# Altium schematic sheet Power.SchDoc
size A3
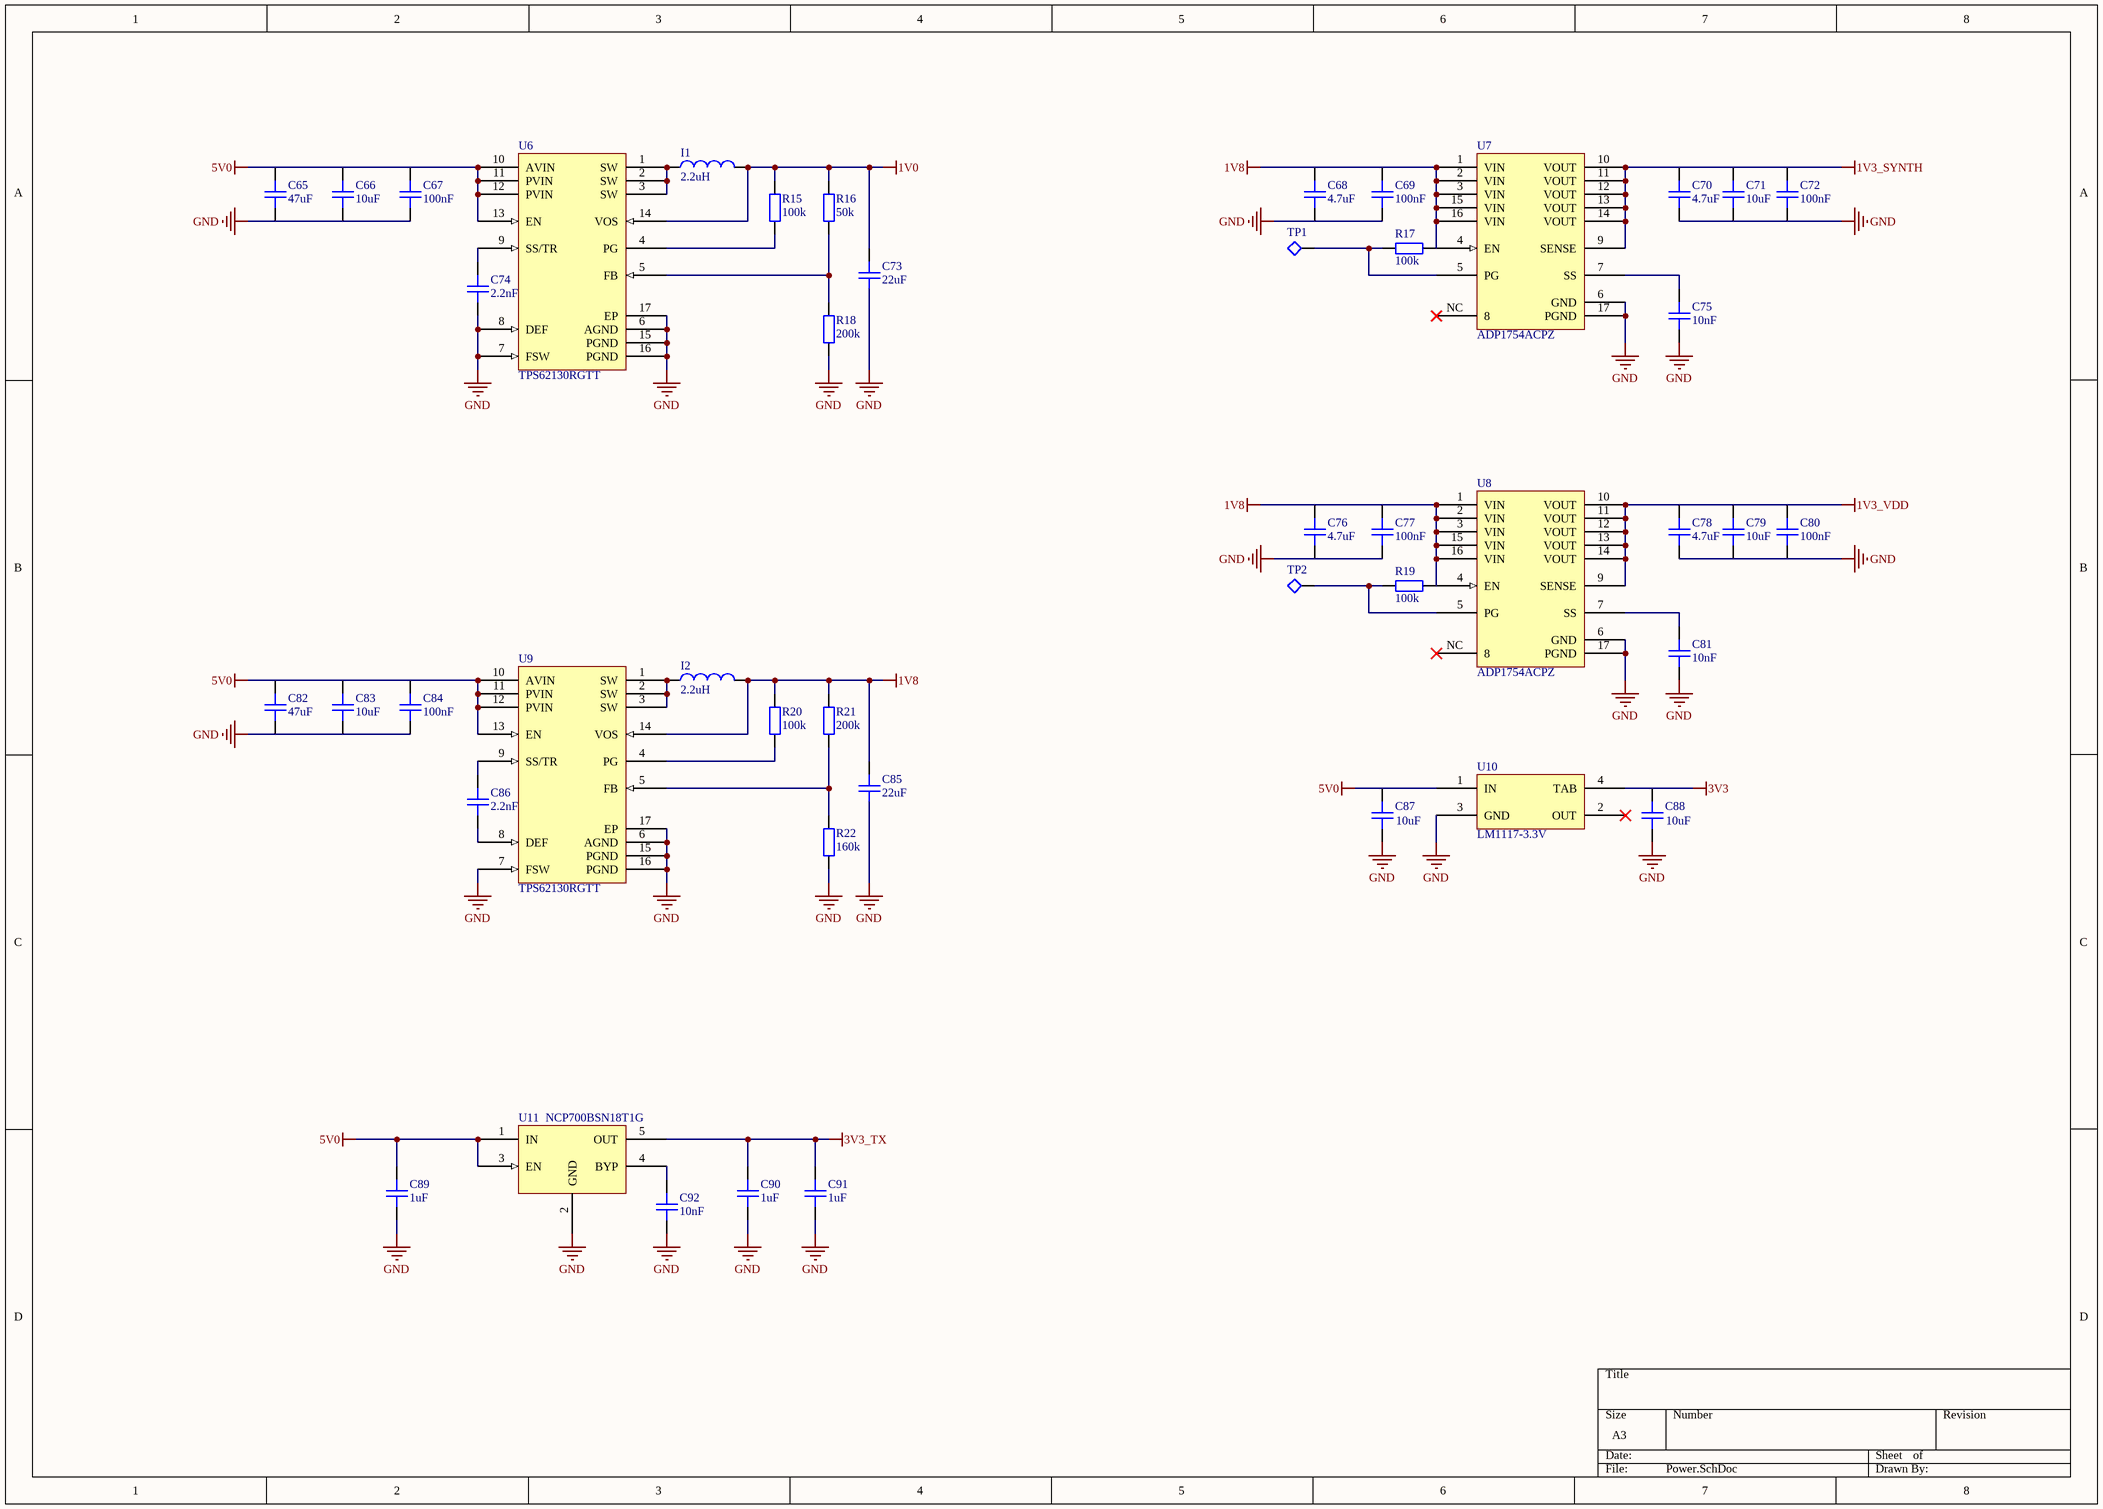
[diagram p0: Power.SchDoc]

## Parts
C65  47uF  [CAP0402]
C66  10uF  [CAP0402]
C67  100nF  [CAP0402]
C68  4.7uF  [CAP0402]
C69  100nF  [CAP0402]
C70  4.7uF  [CAP0402]
C71  10uF  [CAP0402]
C72  100nF  [CAP0402]
C73  22uF  [CAP0402]
C74  2.2nF  [CAP0402]
C75  10nF  [CAP0402]
C76  4.7uF  [CAP0402]
C77  100nF  [CAP0402]
C78  4.7uF  [CAP0402]
C79  10uF  [CAP0402]
C80  100nF  [CAP0402]
C81  10nF  [CAP0402]
C82  47uF  [CAP0402]
C83  10uF  [CAP0402]
C84  100nF  [CAP0402]
C85  22uF  [CAP0402]
C86  2.2nF  [CAP0402]
C87  10uF  [CAP0402]
C88  10uF  [CAP0402]
C89  1uF  [CAP0402]
C90  1uF  [CAP0402]
C91  1uF  [CAP0402]
C92  10nF  [CAP0402]
I1  2.2uH
I2  2.2uH
R15  100k  [RES0402]
R16  50k  [RES0402]
R17  100k  [RES0402]
R18  200k  [RES0402]
R19  100k  [RES0402]
R20  100k  [RES0402]
R21  200k  [RES0402]
R22  160k  [RES0402]
TP1  TP  (value not drawn)
TP2  TP  (value not drawn)
U6  TPS62130RGTT  [QFN50P300X300X80_HS-17N]
U7  ADP1754ACPZ  [QFN65P400X400X80_HS-17N]
U8  ADP1754ACPZ  [QFN65P400X400X80_HS-17N]
U9  TPS62130RGTT  [QFN50P300X300X80_HS-17N]
U10  LM1117-3.3V
U11  NCP700BSN18T1G

## Nets
1V0: I1.2 U6.14(VOS)
1V3_SYNTH: U7.9(SENSE) U7.10(VOUT) U7.11(VOUT) U7.12(VOUT) U7.13(VOUT) U7.14(VOUT)
1V3_VDD: U8.9(SENSE) U8.10(VOUT) U8.11(VOUT) U8.12(VOUT) U8.13(VOUT) U8.14(VOUT)
1V8: I2.2 U7.1(VIN) U7.2(VIN) U7.3(VIN) U7.4(EN) U7.15(VIN) U7.16(VIN) U8.1(VIN) U8.2(VIN) U8.3(VIN) U8.4(EN) U8.15(VIN) U8.16(VIN) U9.14(VOS)
3V3: U10.4(TAB)
3V3_TX: U11.5(OUT)
5V0: U6.10(AVIN) U6.11(PVIN) U6.12(PVIN) U6.13(EN) U9.10(AVIN) U9.11(PVIN) U9.12(PVIN) U9.13(EN) U10.1(IN) U11.1(IN) U11.3(EN)
GND: C73.1 C85.1 U6.6(AGND) U6.7(FSW) U6.8(DEF) U6.15(PGND) U6.16(PGND) U6.17(EP) U7.6(GND) U7.17(PGND) U8.6(GND) U8.17(PGND) U9.6(AGND) U9.7(FSW) U9.15(PGND) U9.16(PGND) U9.17(EP) U10.3(GND) U11.2(GND)
NetI1_1: I1.1 U6.1(SW) U6.2(SW) U6.3(SW)
NetI2_1: I2.1 U9.1(SW) U9.2(SW) U9.3(SW)
NetTP1_1: TP1.1(NC) U7.5(PG)
NetTP2_1: TP2.1(NC) U8.5(PG)

Not connected (* = marked no-connect by the designer): C65 1 2; C66 1 2; C67 1 2; C68 1 2; C69 1 2; C70 1 2; C71 1 2; C72 1 2; C73 2; C74 1 2; C75 1 2; C76 1 2; C77 1 2; C78 1 2; C79 1 2; C80 1 2; C81 1 2; C82 1 2; C83 1 2; C84 1 2; C85 2; C86 1 2; C87 1 2; C88 1 2; C89 1 2; C90 1 2; C91 1 2; C92 1 2; R15 1 2; R16 1 2; R17 1 2; R18 1 2; R19 1 2; R20 1 2; R21 1 2; R22 1 2; U6 4(PG) 5(FB) 9(SS/TR); U7 7(SS) NC(8)*; U8 7(SS) NC(8)*; U9 4(PG) 5(FB) 8(DEF) 9(SS/TR); U10 2(OUT)*; U11 4(BYP)

## Notes on the sheet
- Labels drawn without touching a wire or pin: GND

## Library data of the parts
C65-C72 C74-C84 C86-C92 = Cap_0402
  C65 C82: Value: 47uF
  C66 C83 C87 C88: Value: 10uF
  C67 C84: Value: 100nF
  C68-C72 C75-C81: Value: *
  C74 C86: Value: 2.2nF
  C89-C91: Value: 1uF
  C92: Value: 10nF
C73 C85 = Cap_0402: Value: 2.2nF
I1 I2 = Ind_0805: Part: MLP2012H2R2MT0S1; Value: 2.2uH
R15-R22 = Res_0402: Value: *